# EAGLE schematic ControlShield-v1 (EAGLE 5.07)
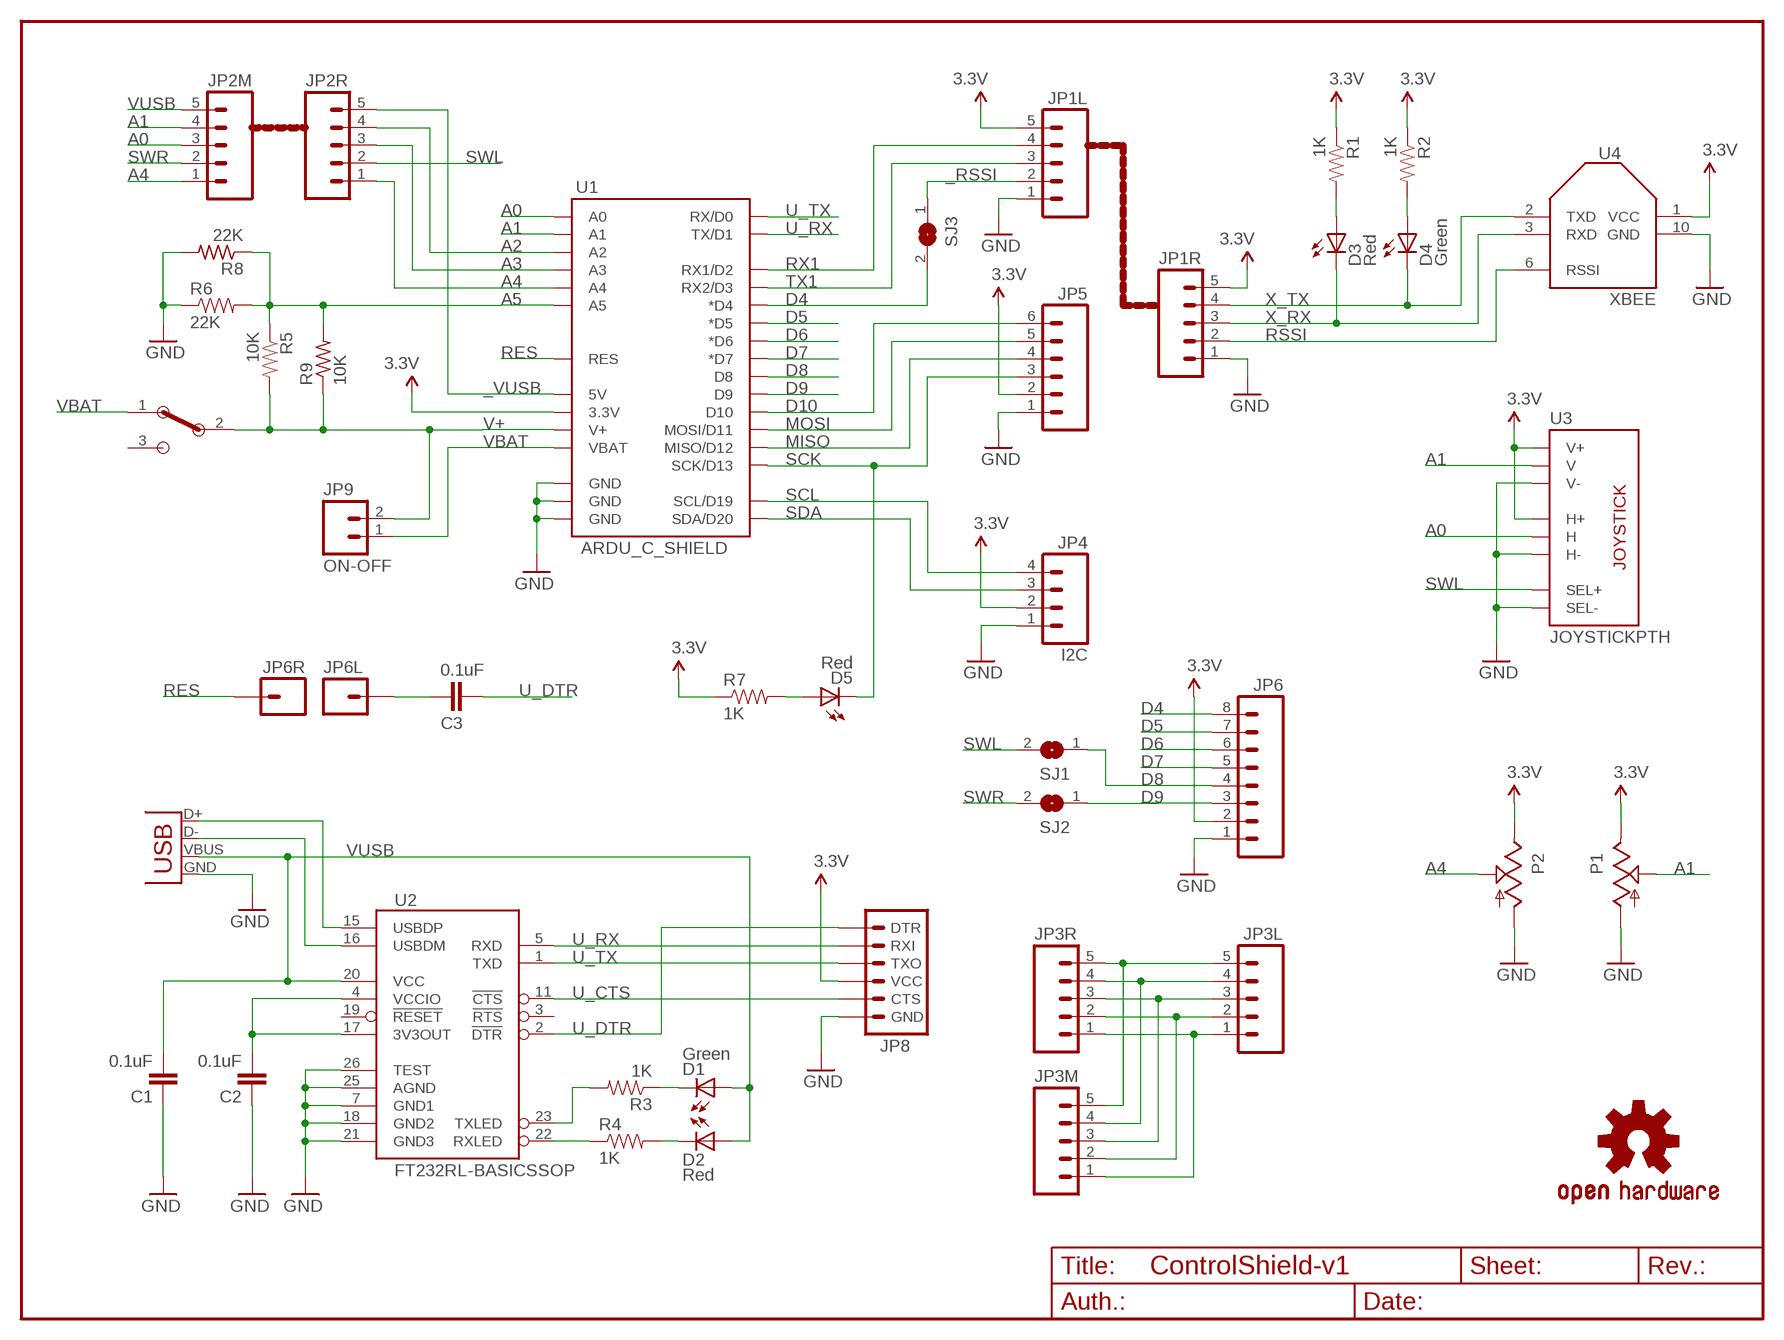
[diagram p0: schematic, sheet 1]

## Parts
C1  0.1uF  CAP0805  [0805]
C2  0.1uF  CAP0805  [0805]
C3  0.1uF  CAP0805  [0805]
D1  Green  LED  [LED]
D2  Red  LED  [LED]
D3  Red  LED  [LED]
D4  Green  LED  [LED]
D5  Red  LED  [LED]
JP1L  M05  [2+3]
JP1R  M05  [2+3]
JP2M  M05  [2+3]
JP2R  M05  [2+3]
JP3L  M05  [2+3]
JP3M  M05  [2+3]
JP3R  M05  [2+3]
JP4  I2C  M04  [1X04]
JP5  M06SIP  [1X06]
JP6  M08  [1X08]
JP6L  M01PTH  [1X01]
JP6R  M01PTH  [1X01]
JP8  ARDUINO_SERIAL_PROGRAM  [1X06_F]
JP9  ON-OFF  M02  [1X02]
P1  POT  [ALPS_POT]
P2  POT  [ALPS_POT]
R1  1K  RESISTOR0805-RES  [0805]
R2  1K  RESISTOR0805-RES  [0805]
R3  1K  RESISTOR0805-RES  [0805]
R4  1K  RESISTOR0805-RES  [0805]
R5  10K  RESISTOR0805-RES  [0805]
R6  22K  RESISTOR0805-RES  [0805]
R7  1K  RESISTOR0805-RES  [0805]
R8  22K  R-US_0207/7  [0207/7]
R9  10K  R-US_0207/7  [0207/7]
S4  EG1224  [EG1224]
SJ1  SJ  [SJ]
SJ2  SJ  [SJ]
SJ3  SJ  [SJ]
U1  ARDU_C_SHIELD  ARDU_C_SHIELDSPLIT  [ARDU_C_SHIELD_SPLIT]
U2  FT232RL-BASICSSOP  [SSOP28DB]
U3  JOYSTICKPTH  [JOYSTICK]
U4  XBEE  XBEE-RSSI  [XBEE-SMD]
U$1  OSHW-LOGOM  [OSHW-LOGO-M]
X1  USBSMD  [USB-MINIB]

## Nets
3.3V: JP1L.5 JP1R.5 JP4.2 JP5.2 JP6.2 JP8.4(VCC) P1.P$1(E) P2.P$1(E) R1.1 R2.1 R7.1 U1.3.3V U3.H1(H+) U3.V1(V+) U4.1(VCC)
_RSSI: JP1L.2 SJ3.1
_VUSB: JP2R.5 U1.5V
A0: JP2M.3 U1.A0 U3.H2(H)
A1: JP2M.4 P1.P$2(S) U1.A1 U3.V2(V)
A2: JP2R.4 U1.A2
A3: JP2R.3 U1.A3
A4: JP2M.1 JP2R.1 P2.P$2(S) U1.A4
A5: R5.1 R6.2 R8.1 R9.2 U1.A5
D4: JP6.8 SJ3.2 U1.D4(*D4)
D5: JP6.7 U1.D5(*D5)
D6: JP6.6 U1.D6(*D6)
D7: JP6.5 U1.D7(*D7)
D8: JP6.4 SJ1.1 U1.D8
D9: JP6.3 SJ2.1 U1.D9
D10: JP5.6 U1.D10
GND [vcc]: C1.1 C2.1 JP1L.1 JP1R.1 JP4.1 JP5.1 JP6.1 JP8.6(GND) P1.P$3(A) P2.P$3(A) R6.1 R8.2 U1.GND@0(GND) U1.GND@1(GND) U1.GND@2(GND) U2.7(GND1) U2.18(GND2) U2.21(GND3) U2.25(AGND) U2.26(TEST) U3.B2A(SEL-) U3.H3(H-) U3.V3(V-) U4.10(GND) X1.GND
MISO: JP5.4 U1.D12(MISO/D12)
MOSI: JP5.5 U1.D11(MOSI/D11)
N$4: JP3L.4 JP3M.4 JP3R.4
N$5: JP3L.3 JP3M.3 JP3R.3
N$6: JP3L.2 JP3M.2 JP3R.2
N$7: JP3L.5 JP3M.5 JP3R.5
N$8: D5.A1(A) R7.2
N$9: U2.15(USBDP) X1.D+
N$10: U2.16(USBDM) X1.D-
N$11: C3.2 JP6L.1
N$14: D3.A1(A) R1.2
N$18: R3.2 U2.23(TXLED)
N$19: C2.2 U2.4(VCCIO) U2.17(3V3OUT)
N$22: R4.1 U2.22(RXLED)
N$25: D4.A1(A) R2.2
RES: JP6R.1 U1.RES
RSSI: JP1R.2 U4.6(RSSI)
RX1: JP1L.4 U1.D2(RX1/D2)
SCK: D5.C1(C) JP5.3 U1.D13(SCK/D13)
SCL: JP4.4 U1.D19(SCL/D19)
SDA: JP4.3 U1.D20(SDA/D20)
SWL: JP2R.2 SJ1.2 U3.B1A(SEL+)
SWR: JP2M.2 SJ2.2
TX1: JP1L.3 U1.D3(RX2/D3)
U_CTS: JP8.5(CTS) U2.11(!CTS)
U_DTR: C3.1 JP8.1(DTR) U2.2(!DTR)
U_RX: JP8.2(RXI) U1.TX(TX/D1) U2.5(RXD)
U_RX_LED: D2.C1(C) R4.2
U_TX: JP8.3(TXO) U1.RX(RX/D0) U2.1(TXD)
U_TX_LED: D1.C1(C) R3.1
V+: JP9.2 R5.2 R9.1 S4.2 U1.V+
VBAT: JP9.1 S4.1 U1.VBAT
VGND [vcc]: JP3L.1 JP3M.1 JP3R.1
VUSB: C1.2 D1.A1(A) D2.A1(A) JP2M.5 U2.20(VCC) X1.VBUS
X_RX: D3.C1(C) JP1R.3 U4.3(RXD)
X_TX: D4.C1(C) JP1R.4 U4.2(TXD)
Unconnected: S4.3 U2.3(!RTS) U2.19(!RESET)

## Library data of the parts
C1-C3 = SparkFun:CAP: Capacitor Standard 0603 ceramic capacitor, and 0.1" leaded capacitor.
D1-D5 = wibauxl:LED
JP1L JP1R JP2M JP2R JP3L JP3M JP3R = wibauxl:M05
JP4 = wibauxl:M04
JP5 = SparkFun:M06: Header 6 Standard 6-pin 0.1" header. Use with straight break away headers (SKU : PRT-00116), right angle break away headers (PRT-00553), swiss pins (PRT-00743), machine pins (PRT-00117), and female headers (PRT-00115). Molex polarized connector foot print use with SKU : PRT-08094 with associated crimp pins and housings. NOTES ON THE VARIANTS LOCK and LOCK_LONGPADS... This footprint was designed to help hold the alignment of a through-hole component (i.e. 6-pin header) while soldering it into place. You may notice that each hole has been shifted either up or down by 0.005 of an inch from it's more standard position (which is a perfectly straight line). This slight alteration caused the pins (the squares in the middle) to touch the edges of the holes. Because they are alternating, it causes a "brace" to hold the component in place. 0.005 has proven to be the perfect amount of "off-center" position when using our standard breakaway headers. Although looks a little odd when you look at the bare footprint, once you have a header in there, the alteration is very hard to notice. Also, if you push a header all the way into place, it is covered up entirely on the bottom side. This idea of altering the position of holes to aid alignment will be further integrated into the Sparkfun Library for other footprints. It can help hold any component with 3 or more connection pins.
JP6 = wibauxl:M08
JP6L JP6R = SparkFun:M01: Header 1 Standard 1-pin 0.1" header. Use with straight break away headers (SKU : PRT-00116), right angle break away headers (PRT-00553), swiss pins (PRT-00743), machine pins (PRT-00117), and female headers (PRT-00115).
JP8 = wibauxl:ARDUINO_SERIAL_PROGRAM
JP9 = wibauxl:M02
P1 P2 = SparkFun:POT
R1-R7 = SparkFun:RESISTOR: Resistor Basic schematic elements and footprints for 0603, 1206, and PTH resistors.
R8 R9 = resistor:R-US_: RESISTOR, American symbol
S4 = wibauxl:EG1224
SJ1-SJ3 = jumper:SJ: SMD solder JUMPER
U1 = wibauxl:ARDU_C_SHIELD
U2 = wibauxl:FT232RL-BASIC: USB UART This is the simplified version of the FT232RL unit. Only what you need, nothing you don't. Spark Fun Electronics SKU : COM-00650
U3 = SparkFun:JOYSTICK: Thumb Joystick Joystick commonly found in PS2 controllers. Two pots and a select switch. Footprint proven. Spark Fun Electronics SKU : COM-09032
U4 = wibauxl:XBEE-RSSI
U$1 = SparkFun:OSHW-LOGO: Open Source Hardware Logo This logo indicates the piece of hardware it is found on incorporates a OSHW license and/or adheres to the definition of open source hardware found here: http://freedomdefined.org/OSHW
X1 = SparkFun:USB: USB Connectors USB-B-PTH is fully proven SKU : PRT-00139 USB-miniB is fully proven SKU : PRT-00587 USB-A-PCB is untested. USB-A-H is throughly reviewed, but untested. Spark Fun Electronics SKU : PRT-00437 USB-B-SMT is throughly reviewed, but untested. Needs silkscreen touching up. USB-A-S has not been used/tested USB-MB-H has not been used/tested

## Net classes
0 default: width 0.203 mm
1 vcc: width 0.254 mm